# Altium project openEPS.PrjPcb (part 5 of 5)

## Sheet TCA9548A I2C Multiplexer.SchDoc
size Letter
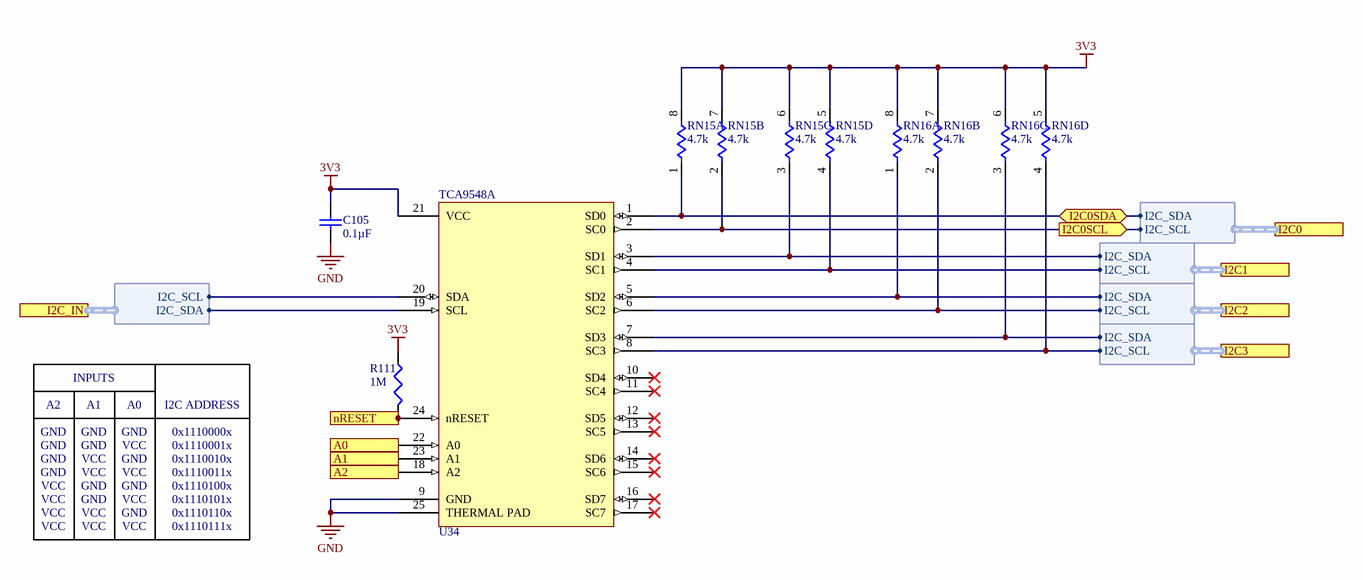
[diagram p23: TCA9548A I2C Multiplexer.SchDoc]

### Parts
C105  value 0.1µF  [TDK-CGA2B]  (hidden comment: Cap)
R111  value 1M  [PANA-ERJ2R]  (hidden comment: Res3)
RN15  value 4.7k  [PANA-EXB28V]  (hidden comment: Res4 Pack1)  (parts A,B,C,D of 4)
RN16  value 4.7k  [PANA-EXB28V]  (hidden comment: Res4 Pack1)  (parts A,B,C,D of 4)
U34  TCA9548A  [TI-RGE0024H]

### Ports
A0 (in), A1 (in), A2 (in), I2C0 (harness TCA9548A_I2C0), I2C0SCL (out), I2C0SDA (bidir), I2C1 (harness TCA9548A_I2C1), I2C2 (harness TCA9548A_I2C2), I2C3 (harness TCA9548A_I2C3), I2C_IN (harness TCA9548A_I2CIN), nRESET (in)

### Harnesses
TCA9548A_I2C1: I2C_SCL, I2C_SDA
TCA9548A_I2C2: I2C_SCL, I2C_SDA
TCA9548A_I2C3: I2C_SCL, I2C_SDA
TCA9548A_I2CIN: I2C_SCL, I2C_SDA
TCA9548A_I2C0: I2C_SCL, I2C_SDA

### Nets
3V3: C105.1 R111.2 RN15.5 RN15.6 RN15.7 RN15.8 RN16.5 RN16.6 RN16.7 RN16.8 U34.21(VCC) U34.22(A0) ; port A0
GND: C105.2 U34.9(GND) U34.18(A2) U34.23(A1) U34.25(THERMAL_PAD) ; port A1, port A2
GIO23: R111.1 U34.24(nRESET) ; port nRESET
I2C0.I2C_SCL: RN15.2 U34.2(SC0) ; port I2C0SCL, port I2C0.I2C_SCL
I2C0.I2C_SDA: RN15.1 U34.1(SD0) ; port I2C0SDA, port I2C0.I2C_SDA
I2C1.I2C_SCL: RN15.4 U34.4(SC1) ; port I2C1.I2C_SCL
I2C1.I2C_SDA: RN15.3 U34.3(SD1) ; port I2C1.I2C_SDA
I2C2.I2C_SCL: RN16.2 U34.6(SC2) ; port I2C2.I2C_SCL
I2C2.I2C_SDA: RN16.1 U34.5(SD2) ; port I2C2.I2C_SDA
I2C3.I2C_SCL: RN16.4 U34.8(SC3) ; port I2C3.I2C_SCL
I2C3.I2C_SDA: RN16.3 U34.7(SD3) ; port I2C3.I2C_SDA
I2C_SCL: U34.20(SDA) ; port I2C_IN.I2C_SCL
I2C_SDA: U34.19(SCL) ; port I2C_IN.I2C_SDA

Not connected (* = marked no-connect by the designer): U34 10(SD4)* 11(SC4)* 12(SD5)* 13(SC5)* 14(SD6)* 15(SC6)* 16(SD7)* 17(SC7)*

### Notes on the sheet
- A2
- INPUTS
- A1
- A0
- I2C ADDRESS
- GND
- VCC
- 0x1110000x
- 0x1110001x
- 0x1110010x
- 0x1110011x
- 0x1110100x
- 0x1110101x
- 0x1110110x
- 0x1110111x
- (the "License"); you may not use or redistribute this file except in compliance with the License. You
- This file and the information within it are licensed under the terms of the Apache License, Version 2.0
- Copyright
- Unless required by applicable law or agreed to in writing, content distributed under the License is
- distributed on an "AS IS" BASIS, WITHOUT WARRANTIES OR CONDITIONS OF ANY KIND,
- either express or implied. See the License for the specific language governing permissions and
- limitations under the License.
- may obtain a copy of the License at:
- http://www.apache.org/licenses/LICENSE-2.0
- Title
- Size:
- Date:
- Letter
- Number:
- Time:
- Revision:
- Sheet
- of
- University of Alberta
- Deptartment of Electrical
- and Computer Engineering
- Edmonton AB, Canada
- T6G 1H9
- File:

### Library data of the parts
C105 = PC-TDK-02259: CAP CER 0.1UF 50V X7R 0402; Manufacturer Part Number: CGA2B3X7R1H104K050BB; Index: 2259; Designator: C?; Tolerance: ±10%; Published: 2016-03-16; LatestRevisionDate: 2016-03-16; LatestRevisionNote: ...; PackageReference: 0402 (1005 Metric); Publisher: AlbertaSat; PackageDescription: Radial Cap, Thru-Hole; 2 Leads; 0.3 in Pin Spacing; Part Number: PC-TDK-02259; Supplier Part Number 1: 445-6899-1-ND; Supplier 1: Digi-key; Supplier Link: http://www.digikey.ca/product-search/en?keywords=445-6899-1-ND; Voltage - Rated: 50V; Temperature Coefficient: X7R; Applications: Automotive; Operating Temperature: -55°C ~ 125°C
R111 = 19704: RES SMD 1M OHM 1% 1/10W 0402; Part Number: 19704; Manufacturer Part Number: ERJ-2RKF1004X; Designator: R?; Power: 0.1W, 1/10W; Temperature Coefficient: ±100ppm/°C; Published: 8-Jun-2000; LatestRevisionDate: 29-May-2009; LatestRevisionNote: IPC-7351 Footprint Added.; PackageReference: 0402 (1005 Metric); Publisher: Altium Limited; PackageDescription: Chip Resistor, 2-Leads, Body 1.00x0.50mm, IPC Low Density; Supplier Part Number 1: P1.00MLCT-ND; Supplier 1: Digi-Key; Supplier Link: http://www.digikey.ca/product-search/en?keywords=P1.00MLCT-ND; Tolerance: ±1%; Operating Temperature: -55°C ~ 155°C
RN15 RN16 = 19961: RES ARRAY 4 RES 4.7K OHM 0804; Part Number: 19961; Manufacturer Part Number: EXB-28V472JX; Sim Note: Enter the Resistance value into parameter field.; Designator: RN?; Tolerance: ±5%; Power: 62.5mW; Temperature Coefficient: ±200ppm/°C; Code_JEDEC: MS-012-AC; Supplier Part Number 1: Y7472CT-ND; Supplier 1: Digi-Key; Supplier Link: http://www.digikey.ca/product-search/en?keywords=Y7472CT-ND; PackageReference: 0804, Convex, Long Side Terminals
U34 = 159: IC BUS SWITCH 1 X 8:1 24VQFN; Part Number: 159; Designator: U?; Supplier Part Number 2: 595-TCA9548ARGERQ1; Supplier 2: Mouser; Manufacturer Part Number: TCA9548ARGERQ1; Supplier Part Number 1: 296-TCA9548ARGERQ1CT-ND; Supplier 1: Digi-Key; Supplier Link: #https://www.digikey.ca/en/products/detail/texas-instruments/TCA9548ARGERQ1/10434845#; PackageReference: 24-VFQFN Exposed Pad; Operating Temperature: -40°C ~ 85°C (TA)

## Nets that join several sheets
1V2: U_INA381A Overcurrent Protection2 (C65_1.2 R86_1.1), TMS570LS1224 Microcontroller (23 pins)
3V3: openEPS (5 pins), U_Output Channels/U_INA226 Current Monitor1 (C9_1.2 C11_1.2 U6_1.6 U7_1.1), U_Output Channels/U_INA226 Current Monitor2 (5 pins), U_Output Channels/U_INA226 Current Monitor3 (C9_3.2 C11_3.2 U6_3.6 U7_3.1), U_Output Channels/U_INA226 Current Monitor4 (C9_4.2 C11_4.2 U6_4.6 U7_4.1), U_Output Channels/U_INA226 Current Monitor5 (5 pins), U_Output Channels/U_INA226 Current Monitor6 (6 pins), U_Output Channels/U_INA226 Current Monitor7 (5 pins), U_Output Channels/U_INA226 Current Monitor8 (5 pins), U_Output Channels/U_INA226 Current Monitor9 (C9_9.2 C11_9.2 U6_9.6 U7_9.1), U_Output Channels/U_INA226 Current Monitor10 (5 pins), U_Output Channels/U_INA226 Current Monitor11 (C9_11.2 C11_11.2 U6_11.6 U7_11.1), U_Output Channels/U_INA226 Current Monitor12 (C9_12.2 C11_12.2 U6_12.6 U7_12.1), U_Output Channels/U_INA226 Current Monitor13 (C9_13.2 C11_13.2 U6_13.6 U7_13.1), U_Output Channels/U_INA226 Current Monitor14 (5 pins), U_Output Channels/U_INA226 Current Monitor15 (C9_15.2 C11_15.2 U6_15.6 U7_15.1), U_Output Channels/U_INA226 Current Monitor16 (C9_16.2 C11_16.2 U6_16.6 U7_16.1), U_Output Channels/U_INA226 Current Monitor17 (C9_17.2 C11_17.2 U6_17.6 U7_17.1), U_Output Channels/U_INA226 Current Monitor18 (C9_18.2 C11_18.2 U6_18.6 U7_18.1), TCAN337 CANbus Transciever (C6.1 U3.3), U_INA381A Overcurrent Protection2 (7 pins), U_INA381A Overcurrent Protection1 (8 pins), U_INA226 Current Monitor19 (5 pins), AD5324 Digital-to-Analog Converter (6 pins), RV-3032-C7 RTC (C22.1 R58.2 U15.4 U15.6), U_INA226 Current Sensor1 (C18_1.2 U11_1.2 U11_1.6), U_INA226 Current Sensor2 (C18_2.2 U11_2.6), U_INA226 Current Sensor3 (C18_3.2 U11_3.6), TCA9548A Solar Panel I2C Multiplexer (C80.1 R101.2 U22.21), U_Solar Power Converter with MPPT1 (C12_1.2 C13_1.2 U8_1.4 U8_1.16), U_Solar Power Converter with MPPT2 (C12_2.2 C13_2.2 U8_2.4 U8_2.16), U_Solar Power Converter with MPPT3 (5 pins), U_Solar Power Converter with MPPT4 (C12_4.2 C13_4.2 U8_4.4 U8_4.16), TMS570LS1224 Microcontroller (19 pins), Battery Voltage Monitor (6 pins), FPP Connector (10 pins), Battery Board Connector (P11.2), TMP117 Temperature Sensors (12 pins), TCA9548A I2C Multiplexer (12 pins)
GND: openEPS (10 pins), U_Output Channels/U_INA226 Current Monitor1 (7 pins), U_Output Channels/U_INA226 Current Monitor2 (6 pins), U_Output Channels/U_INA226 Current Monitor3 (6 pins), U_Output Channels/U_INA226 Current Monitor4 (6 pins), U_Output Channels/U_INA226 Current Monitor5 (6 pins), U_Output Channels/U_INA226 Current Monitor6 (5 pins), U_Output Channels/U_INA226 Current Monitor7 (5 pins), U_Output Channels/U_INA226 Current Monitor8 (5 pins), U_Output Channels/U_INA226 Current Monitor9 (6 pins), U_Output Channels/U_INA226 Current Monitor10 (5 pins), U_Output Channels/U_INA226 Current Monitor11 (5 pins), U_Output Channels/U_INA226 Current Monitor12 (5 pins), U_Output Channels/U_INA226 Current Monitor13 (6 pins), U_Output Channels/U_INA226 Current Monitor14 (5 pins), U_Output Channels/U_INA226 Current Monitor15 (5 pins), U_Output Channels/U_INA226 Current Monitor16 (5 pins), U_Output Channels/U_INA226 Current Monitor17 (6 pins), U_Output Channels/U_INA226 Current Monitor18 (5 pins), TCAN337 CANbus Transciever (C5.1 C6.2 U3.2), U_INA381A Overcurrent Protection2 (7 pins), U_INA381A Overcurrent Protection1 (7 pins), U_INA226 Current Monitor19 (5 pins), EPS Stack Header (8 pins), AD5324 Digital-to-Analog Converter (5 pins), TPS53319 1.2V Buck Converter (15 pins), TPS53319 3.3V Buck Converter (15 pins), TPS53319 5.0V Buck Converter (15 pins), MAX16998A Watchdog Circuit (7 pins), RV-3032-C7 RTC (7 pins), U_INA226 Current Sensor1 (C18_1.1 C19_1.1 U11_1.7), U_INA226 Current Sensor2 (C18_2.1 C19_2.1 U11_2.7), U_INA226 Current Sensor3 (C18_3.1 C19_3.1 U11_3.7), TCA9548A Solar Panel I2C Multiplexer (6 pins), Solar Panel Connectors (48 pins), U_Solar Power Converter with MPPT1 (C12_1.1 C13_1.1 U8_1.3 U8_1.17), U_Solar Power Converter with MPPT1/U_LTC3119 Buck Boost Converter (24 pins), U_Solar Power Converter with MPPT2 (C12_2.1 C13_2.1 U8_2.3 U8_2.17), U_Solar Power Converter with MPPT2/U_LTC3119 Buck Boost Converter (24 pins), U_Solar Power Converter with MPPT3 (C12_3.1 C13_3.1 U8_3.3 U8_3.17), U_Solar Power Converter with MPPT3/U_LTC3119 Buck Boost Converter (24 pins), U_Solar Power Converter with MPPT4 (5 pins), U_Solar Power Converter with MPPT4/U_LTC3119 Buck Boost Converter (24 pins), TMS570LS1224 Microcontroller (41 pins), Battery Voltage Monitor (7 pins), FPP Connector (11 pins), Battery Board Connector (P12.2), TMP117 Temperature Sensors (12 pins), TCA9548A I2C Multiplexer (5 pins)
PV_3V3: U_INA226 Current Monitor19 (C10_19.2 R46_19.2), TCA9548A Solar Panel I2C Multiplexer (16 pins), Solar Panel Connectors (8 pins)
VBATT: openEPS (P9.2), MAX16998A Watchdog Circuit (Q4.2), U_Solar Power Converter with MPPT1 (R50_1.1), U_Solar Power Converter with MPPT2 (R50_2.1), U_Solar Power Converter with MPPT3 (R50_3.1), U_Solar Power Converter with MPPT4 (R50_4.1), FPP Connector (P10.17 P10.18 P10.19 P10.20), Battery Board Connector (P12.1)
VBATT_BUS: Jumper Matrix (18 pins), TPS53319 1.2V Buck Converter (12 pins), TPS53319 3.3V Buck Converter (12 pins), TPS53319 5.0V Buck Converter (12 pins), Battery Voltage Monitor (R106.1)
VBATT_SWITCHED: MAX16998A Watchdog Circuit (Q5.3), Battery Voltage Monitor (R106.2)
VREF(1.6V): openEPS (C3.1 C4.2 U2.6), AD5324 Digital-to-Analog Converter (U5.5)
1V2IN: Jumper Matrix (18 pins), U_INA381A Overcurrent Protection2 (R86_1.2), U_INA226 Current Sensor2 (C19_2.2 R56_2.1)
3V3IN: Jumper Matrix (18 pins), U_INA381A Overcurrent Protection1 (R86_2.2), U_INA226 Current Monitor19 (Q3_19.2), U_INA226 Current Sensor1 (C19_1.2 R56_1.1)
5V0IN: Jumper Matrix (18 pins), U_INA226 Current Sensor3 (C19_3.2 R56_3.1)
CAN1_RX: TCAN337 CANbus Transciever (U3.4), TMS570LS1224 Microcontroller (U1.90)
CAN1_TX: TCAN337 CANbus Transciever (U3.1), TMS570LS1224 Microcontroller (U1.89)
CAN_N: TCAN337 CANbus Transciever (R42.2 U3.6), EPS Stack Header (RN1.2 RN2.2)
CAN_P: TCAN337 CANbus Transciever (R41.1 U3.7), EPS Stack Header (RN1.1 RN2.1)
CHARGE_EN: openEPS (D1.2 R3.2), FPP Connector (P10.2), Battery Board Connector (P11.1)
GIO0: TCAN337 CANbus Transciever (U3.5), TMS570LS1224 Microcontroller (U1.1)
GIO1: MAX16998A Watchdog Circuit (U9.6), TMS570LS1224 Microcontroller (U1.2)
GIO2: U_Output Channels/U_INA226 Current Monitor16 (R48_16.1 U6_16.3 U7_16.3), TMS570LS1224 Microcontroller (U1.5)
GIO3: U_Output Channels/U_INA226 Current Monitor13 (R48_13.1 U6_13.3 U7_13.3), TMS570LS1224 Microcontroller (U1.6)
GIO4: U_Output Channels/U_INA226 Current Monitor14 (R48_14.1 U6_14.3 U7_14.3), TMS570LS1224 Microcontroller (U1.9)
GIO6: U_Output Channels/U_INA226 Current Monitor11 (R48_11.1 U6_11.3 U7_11.3), TMS570LS1224 Microcontroller (U1.16)
GIO7: U_Output Channels/U_INA226 Current Monitor12 (R48_12.1 U6_12.3 U7_12.3), TMS570LS1224 Microcontroller (U1.22)
GIO8: U_Output Channels/U_INA226 Current Monitor10 (R48_10.1 U6_10.3 U7_10.3), TMS570LS1224 Microcontroller (U1.23)
GIO9: U_Output Channels/U_INA226 Current Monitor9 (R48_9.1 U6_9.3 U7_9.3), TMS570LS1224 Microcontroller (U1.24)
GIO10: U_Output Channels/U_INA226 Current Monitor2 (R48_2.1 U6_2.3 U7_2.3), TMS570LS1224 Microcontroller (U1.25)
GIO11: U_Output Channels/U_INA226 Current Monitor1 (R48_1.1 U6_1.3 U7_1.3), TMS570LS1224 Microcontroller (U1.30)
GIO12: U_Output Channels/U_INA226 Current Monitor4 (R48_4.1 U6_4.3 U7_4.3), TMS570LS1224 Microcontroller (U1.31)
GIO13: U_Output Channels/U_INA226 Current Monitor3 (R48_3.1 U6_3.3 U7_3.3), TMS570LS1224 Microcontroller (U1.33)
GIO14: U_Output Channels/U_INA226 Current Monitor6 (R48_6.1 U6_6.3 U7_6.3), TMS570LS1224 Microcontroller (U1.35)
GIO15: U_Output Channels/U_INA226 Current Monitor5 (R48_5.1 U6_5.3 U7_5.3), TMS570LS1224 Microcontroller (U1.36)
GIO19: RV-3032-C7 RTC (U15.3), TMS570LS1224 Microcontroller (U1.40)
GIO20: U_Output Channels/U_INA226 Current Monitor8 (R48_8.1 U6_8.3 U7_8.3), TMS570LS1224 Microcontroller (U1.41)
GIO21: U_Output Channels/U_INA226 Current Monitor7 (R48_7.1 U6_7.3 U7_7.3), TMS570LS1224 Microcontroller (U1.54)
GIO22: TMS570LS1224 Microcontroller (U1.91), FPP Connector (P10.6)
GIO23: TCA9548A Solar Panel I2C Multiplexer (R101.1 U22.24), TMS570LS1224 Microcontroller (U1.92), TCA9548A I2C Multiplexer (R111.1 U34.24)
GIO26: AD5324 Digital-to-Analog Converter (U5.10), TMS570LS1224 Microcontroller (U1.107)
GIO27: U_Output Channels/U_INA226 Current Monitor1 (R48_1.2), U_Output Channels/U_INA226 Current Monitor2 (R48_2.2), U_Output Channels/U_INA226 Current Monitor3 (R48_3.2), U_Output Channels/U_INA226 Current Monitor4 (R48_4.2), U_Output Channels/U_INA226 Current Monitor5 (R48_5.2), U_Output Channels/U_INA226 Current Monitor6 (R48_6.2), U_Output Channels/U_INA226 Current Monitor7 (R48_7.2), U_Output Channels/U_INA226 Current Monitor8 (R48_8.2), U_Output Channels/U_INA226 Current Monitor9 (R48_9.2), U_Output Channels/U_INA226 Current Monitor10 (R48_10.2), U_Output Channels/U_INA226 Current Monitor11 (R48_11.2), U_Output Channels/U_INA226 Current Monitor12 (R48_12.2), U_Output Channels/U_INA226 Current Monitor13 (R48_13.2), U_Output Channels/U_INA226 Current Monitor14 (R48_14.2), U_Output Channels/U_INA226 Current Monitor15 (R48_15.2), U_Output Channels/U_INA226 Current Monitor16 (R48_16.2), U_Output Channels/U_INA226 Current Monitor17 (R48_17.2), U_Output Channels/U_INA226 Current Monitor18 (R48_18.2), U_INA226 Current Monitor19 (R48_19.2), TMS570LS1224 Microcontroller (U1.118)
GIO30: TCAN337 CANbus Transciever (U3.8), TMS570LS1224 Microcontroller (U1.126)
GIO31: U_INA226 Current Monitor19 (R48_19.1 U6_19.3 U7_19.3), TMS570LS1224 Microcontroller (U1.127)
GIO35: U_Output Channels/U_INA226 Current Monitor17 (R48_17.1 U6_17.3 U7_17.3), TMS570LS1224 Microcontroller (U1.140)
GIO36: U_Output Channels/U_INA226 Current Monitor18 (R48_18.1 U6_18.3 U7_18.3), TMS570LS1224 Microcontroller (U1.141)
GIO37: U_Output Channels/U_INA226 Current Monitor15 (R48_15.1 U6_15.3 U7_15.3), TMS570LS1224 Microcontroller (U1.142)
I2C0.I2C_SCL: U_INA381A Overcurrent Protection2 (U19_1.5), U_INA381A Overcurrent Protection1 (U19_2.5), U_INA226 Current Monitor19 (U6_19.2 U6_19.5), RV-3032-C7 RTC (U15.8), U_INA226 Current Sensor1 (U11_1.1 U11_1.5), U_INA226 Current Sensor2 (U11_2.1 U11_2.5), U_INA226 Current Sensor3 (U11_3.1 U11_3.2 U11_3.5), U_Solar Power Converter with MPPT1 (U8_1.6), U_Solar Power Converter with MPPT2 (U8_2.5 U8_2.6), U_Solar Power Converter with MPPT3 (U8_3.6), U_Solar Power Converter with MPPT4 (U8_4.6), Battery Voltage Monitor (U24.5), TMP117 Temperature Sensors (5 pins), TCA9548A I2C Multiplexer (RN15.2 U34.2)
I2C0.I2C_SDA: U_INA381A Overcurrent Protection2 (U19_1.4), U_INA381A Overcurrent Protection1 (U19_2.2 U19_2.4), U_INA226 Current Monitor19 (U6_19.4), RV-3032-C7 RTC (U15.2), U_INA226 Current Sensor1 (U11_1.4), U_INA226 Current Sensor2 (U11_2.2 U11_2.4), U_INA226 Current Sensor3 (U11_3.4), U_Solar Power Converter with MPPT1 (U8_1.5 U8_1.7), U_Solar Power Converter with MPPT2 (U8_2.7), U_Solar Power Converter with MPPT3 (U8_3.7), U_Solar Power Converter with MPPT4 (U8_4.7), Battery Voltage Monitor (U24.4), TMP117 Temperature Sensors (5 pins), TCA9548A I2C Multiplexer (RN15.1 U34.1)
I2C1.I2C_SCL: U_Output Channels/U_INA226 Current Monitor1 (U6_1.5), U_Output Channels/U_INA226 Current Monitor2 (U6_2.5), U_Output Channels/U_INA226 Current Monitor3 (U6_3.5), U_Output Channels/U_INA226 Current Monitor4 (U6_4.2 U6_4.5), U_Output Channels/U_INA226 Current Monitor5 (U6_5.5), U_Output Channels/U_INA226 Current Monitor6 (U6_6.5), U_Output Channels/U_INA226 Current Monitor7 (U6_7.5), U_Output Channels/U_INA226 Current Monitor8 (U6_8.2 U6_8.5), U_Output Channels/U_INA226 Current Monitor9 (U6_9.5), U_Output Channels/U_INA226 Current Monitor10 (U6_10.5), U_Output Channels/U_INA226 Current Monitor11 (U6_11.5), U_Output Channels/U_INA226 Current Monitor12 (U6_12.2 U6_12.5), U_Output Channels/U_INA226 Current Monitor13 (U6_13.1 U6_13.5), U_Output Channels/U_INA226 Current Monitor14 (U6_14.1 U6_14.5), U_Output Channels/U_INA226 Current Monitor15 (U6_15.1 U6_15.2 U6_15.5), U_Output Channels/U_INA226 Current Monitor16 (U6_16.1 U6_16.5), TCA9548A I2C Multiplexer (RN15.4 U34.4)
I2C1.I2C_SDA: U_Output Channels/U_INA226 Current Monitor1 (U6_1.4), U_Output Channels/U_INA226 Current Monitor2 (U6_2.4), U_Output Channels/U_INA226 Current Monitor3 (U6_3.2 U6_3.4), U_Output Channels/U_INA226 Current Monitor4 (U6_4.4), U_Output Channels/U_INA226 Current Monitor5 (U6_5.4), U_Output Channels/U_INA226 Current Monitor6 (U6_6.4), U_Output Channels/U_INA226 Current Monitor7 (U6_7.2 U6_7.4), U_Output Channels/U_INA226 Current Monitor8 (U6_8.4), U_Output Channels/U_INA226 Current Monitor9 (U6_9.1 U6_9.4), U_Output Channels/U_INA226 Current Monitor10 (U6_10.1 U6_10.4), U_Output Channels/U_INA226 Current Monitor11 (U6_11.1 U6_11.2 U6_11.4), U_Output Channels/U_INA226 Current Monitor12 (U6_12.1 U6_12.4), U_Output Channels/U_INA226 Current Monitor13 (U6_13.4), U_Output Channels/U_INA226 Current Monitor14 (U6_14.4), U_Output Channels/U_INA226 Current Monitor15 (U6_15.4), U_Output Channels/U_INA226 Current Monitor16 (U6_16.2 U6_16.4), TCA9548A I2C Multiplexer (RN15.3 U34.3)
I2C2.I2C_SCL: U_Output Channels/U_INA226 Current Monitor17 (U6_17.1 U6_17.5), U_Output Channels/U_INA226 Current Monitor18 (U6_18.1 U6_18.5), TMP117 Temperature Sensors (5 pins), TCA9548A I2C Multiplexer (RN16.2 U34.6)
I2C2.I2C_SDA: U_Output Channels/U_INA226 Current Monitor17 (U6_17.4), U_Output Channels/U_INA226 Current Monitor18 (U6_18.2 U6_18.4), TMP117 Temperature Sensors (5 pins), TCA9548A I2C Multiplexer (RN16.1 U34.5)
I2C3.I2C_SCL: Battery Board Connector (P13.2), TCA9548A I2C Multiplexer (RN16.4 U34.8)
I2C3.I2C_SDA: Battery Board Connector (P13.1), TCA9548A I2C Multiplexer (RN16.3 U34.7)
I2C_SCL: TCA9548A Solar Panel I2C Multiplexer (U22.19), TMS570LS1224 Microcontroller (R103.2 U1.3), TCA9548A I2C Multiplexer (U34.20)
I2C_SDA: TCA9548A Solar Panel I2C Multiplexer (U22.20), TMS570LS1224 Microcontroller (R102.2 U1.4), TCA9548A I2C Multiplexer (U34.19)
NetC32_2: TPS53319 1.2V Buck Converter (8 pins), U_INA226 Current Sensor2 (R56_2.2)
NetC44_2: TPS53319 3.3V Buck Converter (8 pins), U_INA226 Current Sensor1 (R56_1.2)
NetC56_2: TPS53319 5.0V Buck Converter (8 pins), U_INA226 Current Sensor3 (R56_3.2)
NetC70_1_2: U_Solar Power Converter with MPPT1 (R49_1.1 R51_1.1), U_Solar Power Converter with MPPT1/U_LTC3119 Buck Boost Converter (8 pins)
NetC70_2_2: U_Solar Power Converter with MPPT2 (R49_2.1 R51_2.1), U_Solar Power Converter with MPPT2/U_LTC3119 Buck Boost Converter (8 pins)
NetC70_3_2: U_Solar Power Converter with MPPT3 (R49_3.1 R51_3.1), U_Solar Power Converter with MPPT3/U_LTC3119 Buck Boost Converter (8 pins)
NetC70_4_2: U_Solar Power Converter with MPPT4 (R49_4.1 R51_4.1), U_Solar Power Converter with MPPT4/U_LTC3119 Buck Boost Converter (8 pins)
NetC73_1_2: U_Solar Power Converter with MPPT1 (R50_1.2), U_Solar Power Converter with MPPT1/U_LTC3119 Buck Boost Converter (7 pins)
NetC73_2_2: U_Solar Power Converter with MPPT2 (R50_2.2), U_Solar Power Converter with MPPT2/U_LTC3119 Buck Boost Converter (7 pins)
NetC73_3_2: U_Solar Power Converter with MPPT3 (R50_3.2), U_Solar Power Converter with MPPT3/U_LTC3119 Buck Boost Converter (7 pins)
NetC73_4_2: U_Solar Power Converter with MPPT4 (R50_4.2), U_Solar Power Converter with MPPT4/U_LTC3119 Buck Boost Converter (7 pins)
NetP1_5: Solar Panel Connectors (P1.5 P1.7 P1.9), U_Solar Power Converter with MPPT1 (R49_1.2)
NetP2_5: Solar Panel Connectors (P2.5 P2.7 P2.9), U_Solar Power Converter with MPPT1 (R51_1.2)
NetP3_5: Solar Panel Connectors (P3.5 P3.7 P3.9), U_Solar Power Converter with MPPT2 (R49_2.2)
NetP4_5: Solar Panel Connectors (P4.5 P4.7 P4.9), U_Solar Power Converter with MPPT2 (R51_2.2)
NetP5_5: Solar Panel Connectors (P5.5 P5.7 P5.9), U_Solar Power Converter with MPPT3 (R49_3.2)
NetP6_5: Solar Panel Connectors (P6.5 P6.7 P6.9), U_Solar Power Converter with MPPT3 (R51_3.2)
NetP7_5: Solar Panel Connectors (P7.5 P7.7 P7.9), U_Solar Power Converter with MPPT4 (R49_4.2)
NetP8_5: Solar Panel Connectors (P8.5 P8.7 P8.9), U_Solar Power Converter with MPPT4 (R51_4.2)
NetQ1_3: AD5324 Digital-to-Analog Converter (Q1.3), U_Solar Power Converter with MPPT4/U_LTC3119 Buck Boost Converter (R95_4.2)
NetQ1_6: AD5324 Digital-to-Analog Converter (Q1.6), U_Solar Power Converter with MPPT3/U_LTC3119 Buck Boost Converter (R95_3.2)
NetQ2_3: AD5324 Digital-to-Analog Converter (Q2.3), U_Solar Power Converter with MPPT2/U_LTC3119 Buck Boost Converter (R95_2.2)
NetQ2_6: AD5324 Digital-to-Analog Converter (Q2.6), U_Solar Power Converter with MPPT1/U_LTC3119 Buck Boost Converter (R95_1.2)
NetR1_2: openEPS (R1.2), TMS570LS1224 Microcontroller (U1.46)
NetR2_2: openEPS (R2.2), TMS570LS1224 Microcontroller (U1.116)
NetR52_1: U_INA381A Overcurrent Protection2 (U19_1.3 U20_1.3), U_INA381A Overcurrent Protection1 (U19_2.3 U20_2.3), TPS53319 1.2V Buck Converter (U16.3), TPS53319 3.3V Buck Converter (U17.3), TPS53319 5.0V Buck Converter (U18.3), MAX16998A Watchdog Circuit (R52.1 R53.2 U9.2), TMS570LS1224 Microcontroller (U1.117), Battery Voltage Monitor (U24.3 U25.3)
NetR57_1: TMS570LS1224 Microcontroller (U1.111), FPP Connector (R57.1)
NetU1_108: TMS570LS1224 Microcontroller (U1.108), FPP Connector (U12.6)
NetU1_109: TMS570LS1224 Microcontroller (U1.109), FPP Connector (U13.6)
NetU1_110: TMS570LS1224 Microcontroller (U1.110), FPP Connector (U13.4)
NetU1_112: TMS570LS1224 Microcontroller (U1.112), FPP Connector (U12.4)
POWER1: U_Output Channels/U_INA226 Current Monitor1 (C10_1.2 R46_1.2), EPS Stack Header (H1.52)
POWER2: U_Output Channels/U_INA226 Current Monitor2 (C10_2.2 R46_2.2), EPS Stack Header (H2.51)
POWER3: U_Output Channels/U_INA226 Current Monitor3 (C10_3.2 R46_3.2), EPS Stack Header (H1.51)
POWER4: U_Output Channels/U_INA226 Current Monitor4 (C10_4.2 R46_4.2), EPS Stack Header (H1.49)
POWER5: U_Output Channels/U_INA226 Current Monitor5 (C10_5.2 R46_5.2), EPS Stack Header (H2.52)
POWER6: U_Output Channels/U_INA226 Current Monitor6 (C10_6.2 R46_6.2), EPS Stack Header (H1.50)
POWER7: U_Output Channels/U_INA226 Current Monitor7 (C10_7.2 R46_7.2), EPS Stack Header (H1.47)
POWER8: U_Output Channels/U_INA226 Current Monitor8 (C10_8.2 R46_8.2), EPS Stack Header (H2.47)
POWER9: U_Output Channels/U_INA226 Current Monitor9 (C10_9.2 R46_9.2), EPS Stack Header (H2.49)
POWER10: U_Output Channels/U_INA226 Current Monitor10 (C10_10.2 R46_10.2), EPS Stack Header (H2.50)
POWER11: U_Output Channels/U_INA226 Current Monitor11 (C10_11.2 R46_11.2), EPS Stack Header (H1.48)
POWER12: U_Output Channels/U_INA226 Current Monitor12 (C10_12.2 R46_12.2), EPS Stack Header (H2.48)
POWER13: U_Output Channels/U_INA226 Current Monitor13 (C10_13.2 R46_13.2), EPS Stack Header (H2.37)
POWER14: U_Output Channels/U_INA226 Current Monitor14 (C10_14.2 R46_14.2), EPS Stack Header (H2.35)
POWER15: U_Output Channels/U_INA226 Current Monitor15 (C10_15.2 R46_15.2), EPS Stack Header (H2.45 H2.46)
POWER16: U_Output Channels/U_INA226 Current Monitor16 (C10_16.2 R46_16.2), EPS Stack Header (H2.36)
POWER17: U_Output Channels/U_INA226 Current Monitor17 (C10_17.2 R46_17.2), EPS Stack Header (H2.25 H2.26)
POWER18: U_Output Channels/U_INA226 Current Monitor18 (C10_18.2 R46_18.2), EPS Stack Header (H2.27 H2.28)
PV_SCL1: TCA9548A Solar Panel I2C Multiplexer (RN11.3 U22.1), Solar Panel Connectors (P8.3)
PV_SCL2: TCA9548A Solar Panel I2C Multiplexer (RN11.1 U22.3), Solar Panel Connectors (P7.3)
PV_SCL3: TCA9548A Solar Panel I2C Multiplexer (RN12.3 U22.5), Solar Panel Connectors (P5.3)
PV_SCL4: TCA9548A Solar Panel I2C Multiplexer (RN12.1 U22.7), Solar Panel Connectors (P6.3)
PV_SCL5: TCA9548A Solar Panel I2C Multiplexer (RN13.4 U22.10), Solar Panel Connectors (P1.3)
PV_SCL6: TCA9548A Solar Panel I2C Multiplexer (RN13.2 U22.12), Solar Panel Connectors (P2.3)
PV_SCL7: TCA9548A Solar Panel I2C Multiplexer (RN14.4 U22.14), Solar Panel Connectors (P3.3)
PV_SCL8: TCA9548A Solar Panel I2C Multiplexer (RN14.2 U22.16), Solar Panel Connectors (P4.3)
PV_SDA1: TCA9548A Solar Panel I2C Multiplexer (RN11.2 U22.2), Solar Panel Connectors (P8.1)
PV_SDA2: TCA9548A Solar Panel I2C Multiplexer (RN11.4 U22.4), Solar Panel Connectors (P7.1)
PV_SDA3: TCA9548A Solar Panel I2C Multiplexer (RN12.4 U22.6), Solar Panel Connectors (P5.1)
PV_SDA4: TCA9548A Solar Panel I2C Multiplexer (RN12.2 U22.8), Solar Panel Connectors (P6.1)
PV_SDA5: TCA9548A Solar Panel I2C Multiplexer (RN13.3 U22.11), Solar Panel Connectors (P1.1)
PV_SDA6: TCA9548A Solar Panel I2C Multiplexer (RN13.1 U22.13), Solar Panel Connectors (P2.1)
PV_SDA7: TCA9548A Solar Panel I2C Multiplexer (RN14.3 U22.15), Solar Panel Connectors (P3.1)
PV_SDA8: TCA9548A Solar Panel I2C Multiplexer (RN14.1 U22.17), Solar Panel Connectors (P4.1)
RBF_ALWAYSOFF: MAX16998A Watchdog Circuit (R54.1 R55.1 U10.3), FPP Connector (P10.8)
RBF_ALWAYSON: openEPS (D1.1 P9.5 R4.1), MAX16998A Watchdog Circuit (6 pins), FPP Connector (P10.4)
RTC_CLK: RV-3032-C7 RTC (U15.7), TMS570LS1224 Microcontroller (U1.14)
SPI1_CLK: EPS Stack Header (RN7.7 RN8.5 RN9.8), TMS570LS1224 Microcontroller (U1.95)
SPI1_MISO: EPS Stack Header (RN7.6 RN8.7 RN9.7), TMS570LS1224 Microcontroller (U1.94)
SPI1_MOSI: EPS Stack Header (RN7.5 RN8.6 RN9.6), TMS570LS1224 Microcontroller (U1.93)
SPI1_nCS: EPS Stack Header (RN7.8 RN8.8 RN9.5), TMS570LS1224 Microcontroller (U1.105)
SPI3_CLK: AD5324 Digital-to-Analog Converter (U5.8), TMS570LS1224 Microcontroller (U1.53)
SPI3_MOSI: AD5324 Digital-to-Analog Converter (U5.9), TMS570LS1224 Microcontroller (U1.52)
UART1_RX: EPS Stack Header (RN3.2 RN4.2 RN5.1 RN6.2), TMS570LS1224 Microcontroller (U1.131)
UART1_TX: EPS Stack Header (RN3.1 RN4.1 RN5.2 RN6.1), TMS570LS1224 Microcontroller (U1.132)
UART2_RX: TMS570LS1224 Microcontroller (U1.38), FPP Connector (U14.4)
UART2_TX: TMS570LS1224 Microcontroller (U1.39), FPP Connector (U14.1)
VIN1: U_Output Channels/U_INA226 Current Monitor1 (Q3_1.2), Jumper Matrix (R5.1 R8.1)
VIN2: U_Output Channels/U_INA226 Current Monitor2 (Q3_2.2), Jumper Matrix (R11.1 R14.1)
VIN3: U_Output Channels/U_INA226 Current Monitor3 (Q3_3.2), Jumper Matrix (R17.1 R20.1)
VIN4: U_Output Channels/U_INA226 Current Monitor4 (Q3_4.2), Jumper Matrix (R23.1 R26.1)
VIN5: U_Output Channels/U_INA226 Current Monitor5 (Q3_5.2), Jumper Matrix (R29.1 R32.1)
VIN6: U_Output Channels/U_INA226 Current Monitor6 (Q3_6.2), Jumper Matrix (R35.1 R38.1)
VIN7: U_Output Channels/U_INA226 Current Monitor7 (Q3_7.2), Jumper Matrix (R6.1 R9.1)
VIN8: U_Output Channels/U_INA226 Current Monitor8 (Q3_8.2), Jumper Matrix (R12.1 R15.1)
VIN9: U_Output Channels/U_INA226 Current Monitor9 (Q3_9.2), Jumper Matrix (R18.1 R21.1)
VIN10: U_Output Channels/U_INA226 Current Monitor10 (Q3_10.2), Jumper Matrix (R24.1 R27.1)
VIN11: U_Output Channels/U_INA226 Current Monitor11 (Q3_11.2), Jumper Matrix (R30.1 R33.1)
VIN12: U_Output Channels/U_INA226 Current Monitor12 (Q3_12.2), Jumper Matrix (R36.1 R39.1)
VIN13: U_Output Channels/U_INA226 Current Monitor13 (Q3_13.2), Jumper Matrix (R7.1 R10.1)
VIN14: U_Output Channels/U_INA226 Current Monitor14 (Q3_14.2), Jumper Matrix (R13.1 R16.1)
VIN15: U_Output Channels/U_INA226 Current Monitor15 (Q3_15.2), Jumper Matrix (R19.1 R22.1)
VIN16: U_Output Channels/U_INA226 Current Monitor16 (Q3_16.2), Jumper Matrix (R25.1 R28.1)
VIN17: U_Output Channels/U_INA226 Current Monitor17 (Q3_17.2), Jumper Matrix (R31.1 R34.1)
VIN18: U_Output Channels/U_INA226 Current Monitor18 (Q3_18.2), Jumper Matrix (R37.1 R40.1)